# EAGLE design Fuen-var-Ardu (EAGLE 7.2.0)
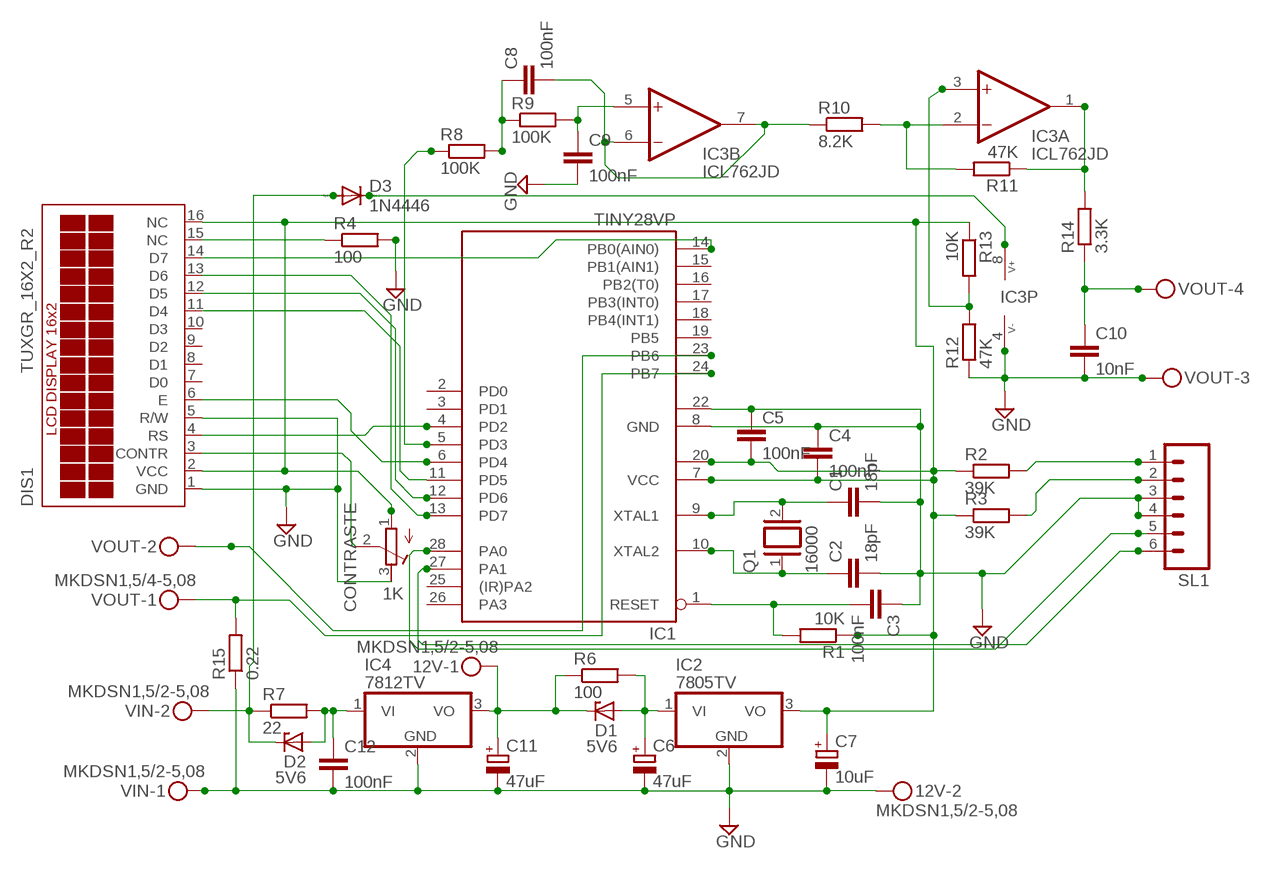
[diagram p0: schematic, sheet 1]

## Parts
12V  MKDSN1,5/2-5,08  [MKDSN1,5/2-5,08]
C1  18pF  C-EU025-025X050  [C025-025X050]
C2  18pF  C-EU025-025X050  [C025-025X050]
C3  100nF  C-EU050-025X075  [C050-025X075]
C4  100nF  C-EU075-032X103  [C075-032X103]
C5  100nF  C-EU050-025X075  [C050-025X075]
C6  47uF  CPOL-EUE2.5-7  [E2,5-7]
C7  10uF  CPOL-EUE2.5-7  [E2,5-7]
C8  100nF  C-EU050-025X075  [C050-025X075]
C9  100nF  C-EU050-025X075  [C050-025X075]
C10  10nF  C-EU050-025X075  [C050-025X075]
C11  47uF  CPOL-EUE2.5-7  [E2,5-7]
C12  100nF  C-EU050-025X075  [C050-025X075]
CONTRASTE  1K  R-TRIMM3296W  [RTRIM3296W]
D1  5V6  ZENER-DIODEDO35Z10  [DO35Z10]
D2  5V6  ZENER-DIODEDO35Z10  [DO35Z10]
D3  1N4446  [DO35-10]
DIS1  TUXGR_16X2_R2  [TUXGR_16X2_R2]
IC1  TINY28VP  [DIL28-3]
IC2  7805TV  [TO220V]
IC3  ICL762JD  [DIL08]
IC4  7812TV  [TO220V]
Q1  16000  XTAL  [Q]
R1  10K  R-EU_0207/10  [0207/10]
R2  39K  R-EU_0207/10  [0207/10]
R3  39K  R-EU_0207/10  [0207/10]
R4  100  R-EU_0207/15  [0207/15]
R6  100  R-EU_0411/12  [0411/12]
R7  22  R-EU_0411/12  [0411/12]
R8  100K  R-EU_0207/10  [0207/10]
R9  100K  R-EU_0207/10  [0207/10]
R10  8.2K  R-EU_0207/10  [0207/10]
R11  47K  R-EU_0207/10  [0207/10]
R12  47K  R-EU_0207/10  [0207/10]
R13  10K  R-EU_0207/10  [0207/10]
R14  3.3K  R-EU_0207/10  [0207/10]
R15  0.22  R-EU_0817/22  [P0817/22]
SL1  M06  [06P]
VIN  MKDSN1,5/2-5,08  [MKDSN1,5/2-5,08]
VOUT  MKDSN1,5/4-5,08  [MKDSN1,5/4-5,08]

## Nets
GND: 12V.2 C1.2 C2.2 C3.1 C4.1 C5.1 C6.- C7.- C9.2 C10.2 C11.- C12.2 IC1.8(GND) IC1.22(GND1) IC2.2(GND) IC3.4(P:V-) IC4.2(GND) R4.2 R12.1 R15.1 SL1.3 SL1.4 VIN.1 VOUT.3
N$1: C3.2 IC1.1(RESET) R1.2
N$2: C2.1 IC1.10(XTAL2) Q1.1
N$3: C1.1 IC1.9(XTAL1) Q1.2
N$4: C4.2 C5.2 C7.+ CONTRASTE.1(A) DIS1.2(VCC) DIS1.16(NC) IC1.7(VCC) IC1.20(VCC1) IC2.3(VO) R1.1 R2.1 R3.1 R13.1
N$5: DIS1.13(D6) IC1.13(PD7)
N$6: IC1.24(PB7) R15.2 VOUT.1
N$7: CONTRASTE.2(S) DIS1.3(CONTR)
N$8: DIS1.14(D7) IC1.14(PB0(AIN0))
N$9: CONTRASTE.3(E) DIS1.5(R/W)
N$10: D3.C IC3.8(P:V+)
N$11: DIS1.12(D5) IC1.12(PD6)
N$12: IC1.23(PB6) VOUT.2
N$13: IC1.27(PA1) SL1.6
N$14: DIS1.11(D4) IC1.11(PD5)
N$15: C6.+ D1.A IC2.1(VI) R6.2
N$16: R2.2 SL1.1
N$17: C10.1 R14.1 VOUT.4
N$18: DIS1.4(RS) IC1.4(PD2)
N$19: IC3.3(A:+IN) R12.2 R13.2
N$20: DIS1.15(NC) R4.1
N$21: DIS1.6(E) IC1.6(PD4)
N$22: 12V.1 C11.+ D1.C IC4.3(VO) R6.1
N$25: R3.2 SL1.2
N$26: IC3.1(A:OUT) R11.1 R14.2
N$27: C8.2 IC3.6(B:-IN) IC3.7(B:OUT) R10.1
N$28: IC3.2(A:-IN) R10.2 R11.2
N$30: C8.1 R8.2 R9.1
N$31: C9.1 IC3.5(B:+IN) R9.2
N$32: C12.1 D2.A IC4.1(VI) R7.2
N$33: IC1.5(PD3) R8.1
N$34: IC1.28(PA0) SL1.5
N$36: D2.C D3.A R7.1 VIN.2
Unconnected: DIS1.7(D0) DIS1.8(D1) DIS1.9(D2) DIS1.10(D3) IC1.2(PD0) IC1.3(PD1) IC1.15(PB1(AIN1)) IC1.16(PB2(T0)) IC1.17(PB3(INT0)) IC1.18(PB4(INT1)) IC1.19(PB5) IC1.21(NC1) IC1.25((IR)PA2) IC1.26(PA3)

## Power pins joined to a net without a drawn wire
GND: DIS1.1(GND)

## Library data of the parts
12V VIN = con-phoenix-508:MKDSN1,5/2-5,08: MKDSN 1,5/ 2-5,08 Printklemme Nennstrom: 13,5 A Nennspannung: 250 V Rastermaß: 5,08 mm Polzahl: 2 Anschlussart: Schraubanschluss Montage: Löten Anschlussrichtung Leiter/Platine: 0 ° Artikelnummer: 1729128 Source: http://eshop.phoenixcontact.com .. 1729128.pdf
C1-C5 C8-C10 C12 = rcl:C-EU: CAPACITOR, European symbol
C6 C7 C11 = rcl:CPOL-EU: POLARIZED CAPACITOR, European symbol
CONTRASTE = rcl:R-TRIMM: Trimm resistor
D1 D2 = diode:ZENER-DIODE: Z-Diode
D3 = diode:1N4446: DIODE high speed (Philips)
DIS1 = display-lcd:TUXGR_16X2_R2: Tuxgraphics LCD display 16x2 characters reflective, without background light Source: tuxgr_12x2_r2.pdf; OC_FARNELL: unknown; OC_NEWARK: unknown
IC1 = atmel:TINY28*P: MICROCONTROLLER 1.8 V 2 Kbytes FLASH; OC_FARNELL: unknown; OC_NEWARK: unknown
IC2 IC4 = linear:78*: Positive VOLTAGE REGULATOR Source: http://cache.national.com/ds/LM/LM78L05.pdf http://www.fairchildsemi.com/ds/LM/LM7805.pdf
IC3 = maxim:ICL762*: Dual Operational Amplifiers Source: http://datasheets.maxim-ic.com/en/ds/ICL7612-ICL764X.pdf; OC_FARNELL: unknown; OC_NEWARK: unknown
Q1 = special:XTAL: CRYSTAL
R1-R4 = resistor:R-EU_: RESISTOR, European symbol
R6-R15 = rcl:R-EU_: RESISTOR, European symbol
SL1 = con-amp-quick:M06: AMP QUICK CONNECTOR; OC_FARNELL: unknown; OC_NEWARK: unknown
VOUT = con-phoenix-508:MKDSN1,5/4-5,08: MKDSN 1,5/ 4-5,08 Printklemme Nennstrom: 13,5 A Nennspannung: 250 V Rastermaß: 5,08 mm Polzahl: 4 Anschlussart: Schraubanschluss Montage: Löten Anschlussrichtung Leiter/Platine: 0 ° Artikelnummer: 1729144 Source: http://eshop.phoenixcontact.com .. 1729144.pdf

## Board
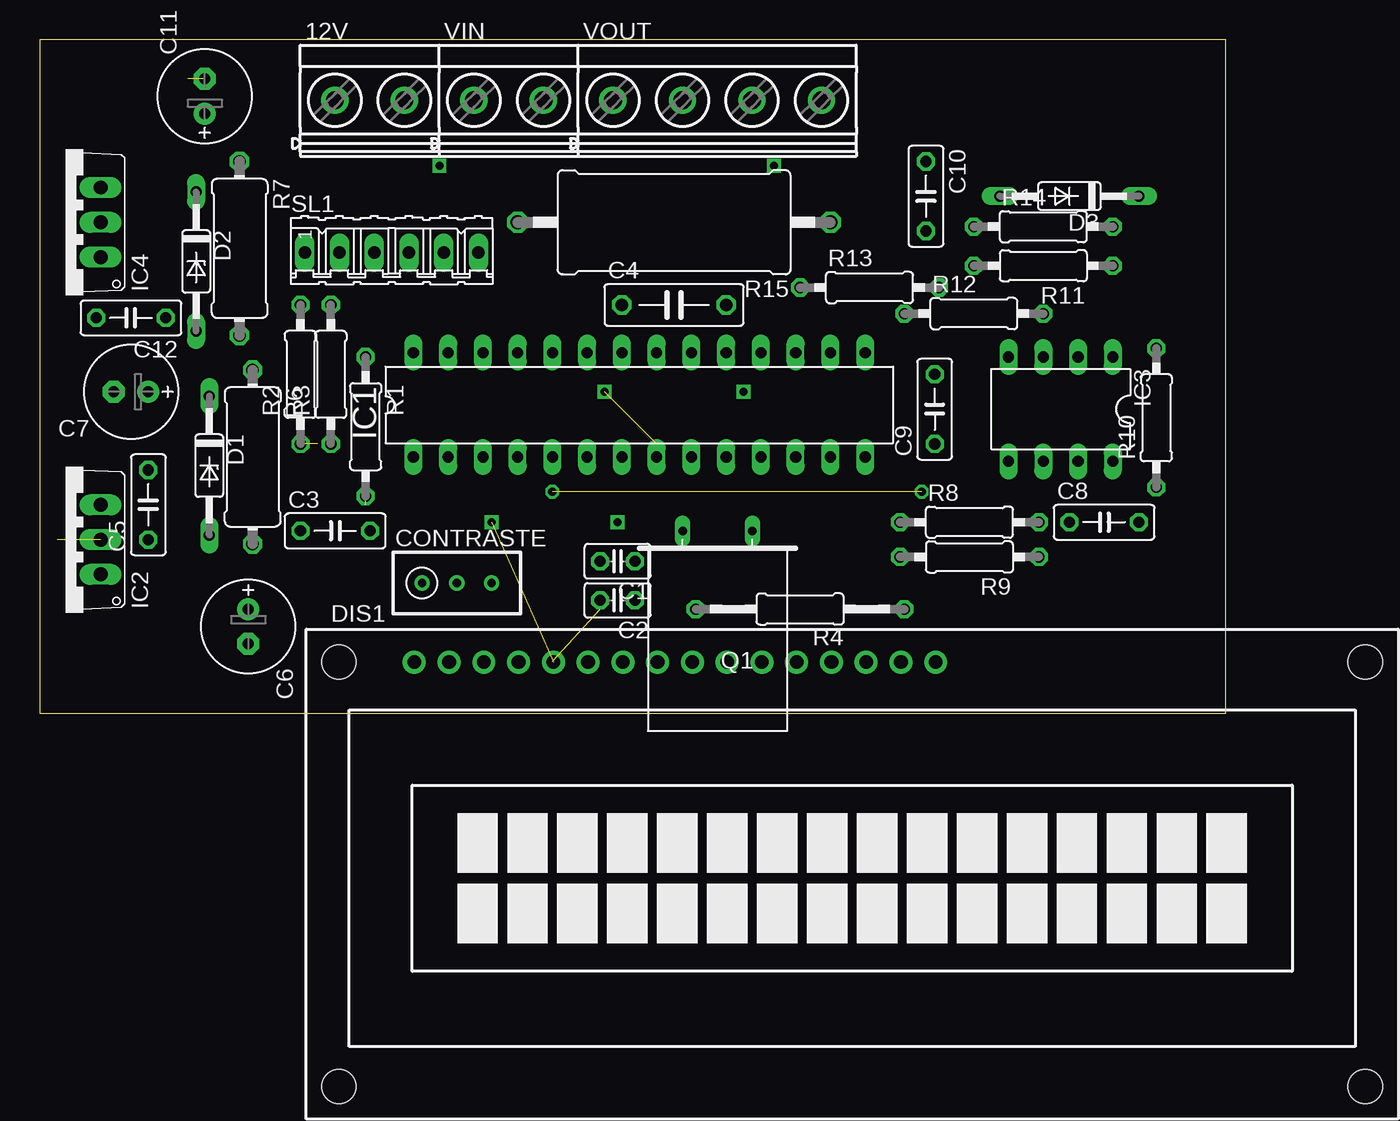
[diagram p1: board, top side]
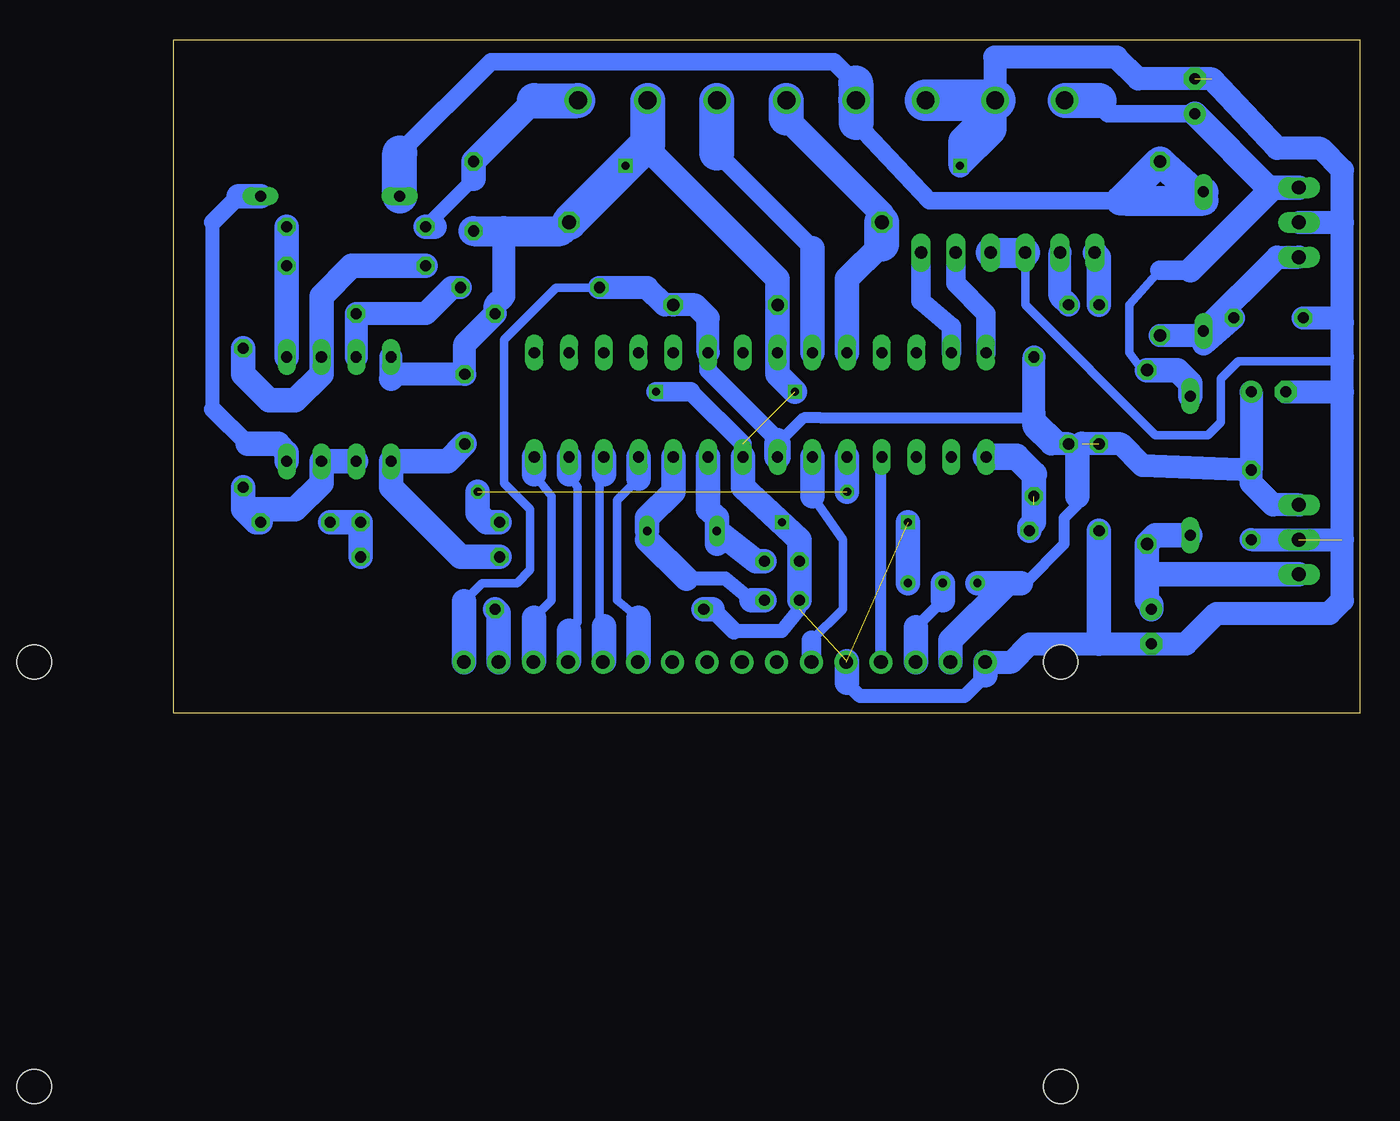
[diagram p2: board, bottom side, seen from below]

Size 86.66 x 49.2 mm. Coordinates in mm from the lower left corner, seen from the top.
Outline: 0,0 86.66,0 86.66,49.2 0,49.2 0,0
Copper layers (1*16): Top 0.035mm / dielectric 1.5mm / Bottom 0.035mm
Design rules "default": minimum track width 10mil, minimum drill 24mil, track to track 8mil, track to pad 8mil, pad to pad 8mil, via to via 8mil, smd to smd 8mil, copper to edge 40mil, drill to drill 8mil, minimum pad ring 10mil, minimum via ring 8mil, stop-mask expansion 4mil, vias tented up to drill 0mil, thermal gap 10mil

### Footprints (pad centres in the part's own frame; a part is rotated, then mirrored left to right if it is on the bottom)
MKDSN1,5/2-5,08 = drill 1.3 pad 2: 1 -2.561,0.025; 2 2.519,0.025
C025-025X050 = drill 0.813 octagon: 1 -1.27,0; 2 1.27,0
C050-025X075 = drill 0.813 octagon: 1 -2.54,0; 2 2.54,0
C075-032X103 = drill 0.914 octagon: 1 -3.81,0; 2 3.81,0
E2,5-7 = drill 0.813 pad 1.6: + -1.27,0 | drill 0.813 pad 1.6 octagon: - 1.27,0
RTRIM3296W = drill 0.61: 1 0,-2.54; 2 0,0; 3 0,2.54
DO35Z10 = drill 0.813 long: A 5.08,0; C -5.08,0
DO35-10 = drill 0.813 long: A 5.08,0; C -5.08,0
TUXGR_16X2_R2 = drill 1 pad 1.676: 1 -32,15.5; 2 -29.46,15.5; 3 -26.92,15.5; 4 -24.38,15.5; 5 -21.84,15.5; 6 -19.3,15.5; 7 -16.76,15.5; 8 -14.22,15.5; 9 -11.68,15.5; 10 -9.14,15.5; 11 -6.6,15.5; 12 -4.06,15.5; 13 -1.52,15.5; 14 1.02,15.5; 15 3.56,15.5; 16 6.1,15.5 | hole 2.5: -37.5,-15.5; 37.5,-15.5; -37.5,15.5; 37.5,15.5
DIL28-3 = drill 0.813 long: 1 -16.51,-3.81; 2 -13.97,-3.81; 3 -11.43,-3.81; 4 -8.89,-3.81; 5 -6.35,-3.81; 6 -3.81,-3.81; 7 -1.27,-3.81; 8 1.27,-3.81; 9 3.81,-3.81; 10 6.35,-3.81; 11 8.89,-3.81; 12 11.43,-3.81; 13 13.97,-3.81; 14 16.51,-3.81; 15 16.51,3.81; 16 13.97,3.81; 17 11.43,3.81; 18 8.89,3.81; 19 6.35,3.81; 20 3.81,3.81; 21 1.27,3.81; 22 -1.27,3.81; 23 -3.81,3.81; 24 -6.35,3.81; 25 -8.89,3.81; 26 -11.43,3.81; 27 -13.97,3.81; 28 -16.51,3.81
TO220V = drill 1.016 long: 1 -2.54,-2.54; 2 0,-2.54; 3 2.54,-2.54
DIL08 = drill 0.813 long: 1 -3.81,-3.81; 2 -1.27,-3.81; 3 1.27,-3.81; 4 3.81,-3.81; 5 3.81,3.81; 6 1.27,3.81; 7 -1.27,3.81; 8 -3.81,3.81
Q = drill 0.61 long: 1 -2.54,-7.62; 2 2.54,-7.62
0207/10 = drill 0.813 octagon: 1 -5.08,0; 2 5.08,0
0207/15 = drill 0.813 octagon: 1 -7.62,0; 2 7.62,0
0411/12 = drill 0.914 octagon: 1 -6.35,0; 2 6.35,0
P0817/22 = drill 1.016 octagon: 1 -11.43,0; 2 11.43,0
06P = drill 0.914 long: 1 -6.35,0; 2 -3.81,0; 3 -1.27,0; 4 1.27,0; 5 3.81,0; 6 6.35,0
MKDSN1,5/4-5,08 = drill 1.3 pad 2: 1 -7.641,0.025; 2 -2.561,0.025; 3 2.519,0.025; 4 7.599,0.025

### Placement (x,y rotation side)
12V  24.13,44.77 0 top
C1  42.23,11.11 180 top
C2  42.23,8.26 180 top
C3  21.59,13.33 0 top
C4  46.36,29.84 0 top
C5  7.94,15.24 90 top
C6  15.24,6.35 270 top
C7  6.67,23.49 180 top
C8  77.79,13.97 0 top
C9  65.41,22.23 90 top
C10  64.77,37.78 270 top
C11  12.06,45.09 90 top
C12  6.67,28.89 180 top
CONTRASTE  30.48,9.53 270 top
D1  12.38,18.1 270 top
D2  11.43,33.02 270 top
D3  75.25,37.78 180 top
DIS1  59.37,-11.75 0 top
IC1  43.82,22.54 0 top
IC2  1.91,12.7 90 top
IC3  74.61,22.23 180 top
IC4  1.91,35.88 90 top
Q1  49.53,5.72 180 top
R1  23.81,20.95 270 top
R2  19.05,24.77 90 top
R3  21.27,24.77 90 top
R4  55.56,7.62 180 top
R6  15.56,18.73 270 top
R7  14.61,33.97 270 top
R8  67.94,13.97 0 top
R9  67.94,11.43 180 top
R10  81.6,21.59 90 top
R11  73.34,32.7 180 top
R12  68.26,29.21 0 top
R13  60.64,31.12 0 top
R14  73.34,35.56 0 top
R15  46.36,35.88 180 top
SL1  25.72,33.66 0 top
VIN  34.29,44.77 0 top
VOUT  49.53,44.77 0 top

### Tracks (layer width: path | path; a pad name or v marks a point on that pad's centre or on a via)
GND  (via drill 0.6)  (4 unrouted)
  Bottom 0.61: SL1.3 24.45,29.85 14.92,20.32 11.11,20.32 10.16,21.27 10.16,24.45 8.89,25.72 1.59,25.72 1.27,26.03 | 40.96,7.62 C2.2
  Bottom 1.016: 45.72,6.03 42.23,6.03 40.96,7.62 | 27.37,2.79 28.89,1.27 36.51,1.27 37.47,2.22
  Bottom 1.27: 47.31,7.62 45.72,6.03 | IC1.8 45.09,19.68 48.9,23.49
  Bottom 1.422: 48.9,23.49 51.44,23.49
  Bottom 1.676: DIS1.1 25.46,3.75 24.13,5.08 19.05,5.08 17.46,5.08 C6.- 12.7,5.08 10.48,7.3 2.22,7.3 1.27,8.26 1.27,12.7 | 1.27,12.7 1.27,23.49 | 1.27,23.49 1.27,26.03 1.27,28.57 | 1.27,28.57 1.27,35.88 | 1.27,35.88 1.27,39.69 2.86,41.27 6.03,41.27 10.79,46.35 16.19,46.35 17.78,47.94 26.67,47.94 26.67,42.55 29.21,40 29.21,41.91 26.99,44.13 26.99,44.45 12V.2 | 29.84,44.77 31.7,44.77 VIN.1 | C12.2 1.59,28.89 1.27,28.57 | C7.- 1.27,23.49 | IC4.2 1.27,35.88 | C5.1 1.27,12.7 | 70.48,24.77 C9.2 65.41,26.99 R12.1 63.18,29.85 62.55,30.48 62.55,35.24 | 70.8,24.45 IC3.4
  Bottom 1.778: 70.48,24.77 70.8,24.45 | C2.2 C1.2 40.96,12.7 45.09,16.51 IC1.8 | R4.2 47.31,7.62 | C3.1 19.05,5.08 | 52.23,41.43 42.55,31.75 C4.1 IC1.22 42.55,24.77 41.28,23.49 | DIS1.1 27.37,2.79 | 37.47,2.22 37.47,3.81
  Bottom 2.184: SL1.4 SL1.3 | C10.2 62.55,35.24 58.42,35.24 R15.1
  Bottom 2.54: VOUT.3 52.05,41.61 52.23,41.43 v53.66,40 R15.1
  Bottom 3.048: 12V.2 VIN.1
N$1  (1 unrouted)
  Bottom 1.778: 23.81,17.46 23.81,15.24 23.81,14.6 23.81,13.97 24.13,13.65 C3.2
  Bottom 1.93: 23.81,17.46 25.08,18.73 IC1.1
N$2
  Bottom 1.016: 52.07,12.7 Q1.1 | 44.45,8.26 46.36,9.84 49.21,9.84
  Bottom 1.778: Q1.1 52.07,14.29 50.17,16.19 IC1.10 | C2.1 44.45,8.26 | 49.21,9.84 52.07,12.7
N$3
  Bottom 1.778: 46.99,12.38 Q1.2 | Q1.2 46.99,14.29 47.62,14.92 IC1.9 | C1.1 44.13,11.11 Q1.2
N$4  (1 unrouted)
  Bottom 0.61: 65.47,8.19 64.14,9.52 61.6,9.52 60.64,10.48 60.64,14.92 62.55,16.83 62.55,27.31 58.74,31.12 R13.1
  Bottom 0.813: 24.77,9.52 24.45,9.52 21.59,12.38 21.59,14.29 20.64,15.24 20.64,18.1 | 42.55,19.68 40.64,21.59 39.37,21.59 23.81,21.59
  Bottom 1.016: 20.32,19.68 R3.1 21.59,19.68 23.81,21.91
  Bottom 1.27: 42.55,20 47.62,25.08 IC1.20
  Bottom 1.676: C7.+ C5.2 | C5.2 15.88,18.1 17.46,19.68 20.32,19.68 | R3.1 22.54,19.68 23.81,20.95 23.81,21.59 23.81,21.91 R1.1 | IC2.3 6.35,15.24 7.94,16.83 C5.2 | 42.55,19.68 42.55,20 | IC1.20 47.62,28.89 48.58,29.85 C4.2 50.8,29.85 52.07,31.12 R13.1
  Bottom 1.778: DIS1.16 65.47,8.19 | CONTRASTE.1 25.72,9.52 | 25.72,9.52 24.77,9.52 | 20.64,15.88 20.64,18.1 20.64,19.37 20.32,19.68 | DIS1.2 29.91,5.33 25.72,9.52
  Bottom 1.93: IC1.7 42.55,19.68
N$5
  Bottom 0.61: DIS1.13 57.79,3.82 | 57.79,6.03 57.15,6.67 57.15,16.51 57.79,17.46
  Bottom 1.778: 57.79,3.82 57.79,6.03 | 57.79,17.46 IC1.13
N$6
  Bottom 1.778: IC1.24 37.47,31.75 34.93,34.29 | R15.2 34.93,36.51 41.91,43.5 | 41.91,44.77 VOUT.1
  Bottom 2.54: 34.93,34.29 R15.2 | 41.91,43.5 41.91,44.77
N$7
  Bottom 0.813: 32.45,6.28 30.48,8.26
  Bottom 1.778: DIS1.3 32.45,6.28 | 30.48,8.26 CONTRASTE.2
N$8
  Bottom 0.61: DIS1.14 60.33,3.82 | 60.33,6.99 59.05,8.26 59.05,15.88 60.33,17.46
  Bottom 1.778: 60.33,3.82 60.33,6.99 | 60.33,17.46 IC1.14
N$9  (1 unrouted)
  Bottom 1.778: CONTRASTE.3 33.02,13.97
N$10
  Bottom 1.016: 83.82,22.23 83.82,35.88
  Bottom 1.27: 81.28,19.68 83.82,22.23 | 83.82,35.88 81.91,37.78
  Bottom 1.778: IC3.8 78.42,19.05 79.06,19.68 81.28,19.68 | 81.91,37.78 D3.C
N$11
  Bottom 0.61: DIS1.12 55.25,3.82 | 55.25,6.35 55.56,6.67 55.56,17.15 55.25,17.46
  Bottom 1.778: 55.25,3.82 55.25,6.35 | 55.25,17.46 IC1.12
N$12
  Bottom 1.27: 40.01,33.97 46.99,40.96
  Bottom 1.778: IC1.23 40.01,33.97 | 46.99,44.77 VOUT.2
  Bottom 2.54: 46.99,40.96 46.99,44.77
N$13
  Bottom 1.422: IC1.27 29.84,28.26 32.07,30.16 SL1.6
N$14
  Bottom 0.61: DIS1.11 52.71,3.82 | 52.71,6.99 54.29,8.26 54.29,15.56 52.71,17.15
  Bottom 1.778: 52.71,3.82 52.71,6.99 | 52.71,17.15 IC1.11
N$15
  Bottom 1.778: C6.+ 15.24,7.94 15.56,8.26 15.56,9.84 | 15.56,9.84 R6.2 14.92,13.02 D1.A | IC2.1 15.24,10.16 15.56,9.84
N$16
  Bottom 1.778: R2.2 19.05,33.34 SL1.1
N$17
  Bottom 1.016: 67.63,35.56 67.63,36.2 64.77,39.05
  Bottom 1.778: R14.1 67.63,35.56 | 64.77,39.05 C10.1 60.33,44.77 | 57.15,44.77 VOUT.4
  Bottom 2.54: 60.33,44.77 57.15,44.77
N$18
  Bottom 0.61: 34.99,18.03 34.93,18.1 IC1.4
  Bottom 0.813: DIS1.4 34.99,18.03
N$19
  Bottom 1.676: R13.2 66.36,31.12 68.26,29.21 R12.2 IC3.3
N$20
  Bottom 1.778: DIS1.15 62.93,7.37 R4.1
N$21
  Bottom 0.61: 40.07,5.33 37.78,7.62 37.78,12.7 40.01,15.88
  Bottom 1.422: DIS1.6 40.07,5.33
  Bottom 1.778: 40.01,15.88 IC1.6
N$22
  Bottom 0.61: 14.61,32.38 16.83,29.85 16.83,26.35 15.88,25.08 R6.1
  Bottom 1.27: C11.+ 18.41,43.81 19.05,44.77 | 21.54,44.77 12V.1
  Bottom 1.422: 12.38,32.38 14.61,32.38
  Bottom 1.778: D1.C 12.38,24.13 13.33,25.08 R6.1 | IC4.3 6.35,38.42 | 6.35,38.42 6.67,38.42 C11.+ | 6.35,38.42 12.38,32.38
  Bottom 2.54: 19.05,44.77 21.54,44.77
N$23  (via drill 0.6)
  other vias: 64.45,16.19
N$24  (via drill 0.6)
  other vias: 37.47,16.19
N$25
  Bottom 1.676: R3.2 21.91,30.48 SL1.2
N$26
  Bottom 1.778: IC3.1 R11.1 R14.2
N$27
  Bottom 1.778: IC3.6 IC3.7 75.88,16.83 77.79,14.92 81.28,14.92 81.6,15.24 | C8.2 80.64,13.97 81.6,14.92 81.6,15.24 | 81.6,15.24 R10.1
N$28
  Bottom 1.778: R11.2 73.66,32.7 75.88,30.48 IC3.2 75.88,24.77 77.79,22.86 79.69,22.86 81.6,24.77 R10.2
N$29  (via drill 0.6)
  other vias: 29.21,40
N$30
  Bottom 1.778: R9.1 R8.2 C8.1
N$31
  Bottom 1.778: C9.1 66.67,18.42 IC3.5 70.8,16.51 65.72,11.43 R9.2
N$32
  Bottom 1.676: D2.A 6.03,33.34 IC4.1 | C12.1 11.43,26.99 | 11.43,26.99 10.48,27.94 D2.A | 11.43,26.99 D2.A | R7.2 11.75,27.62 D2.A
N$33  (1 unrouted)
  Bottom 1.778: IC1.5 37.47,16.19 | R8.1 63.82,13.97 64.45,14.6 64.45,16.19
N$34
  Bottom 1.422: IC1.28 27.3,29.21 29.53,31.43 SL1.5
N$36
  Bottom 1.27: 36.81,43.16 31.43,37.46 17.46,37.46 17.14,37.46 | 70.17,40.96 63.5,47.63 38.42,47.63 36.83,46.04
  Bottom 2.184: 17.46,37.46 R7.1 11.43,37.46 | 11.43,37.46 D2.C | 17.14,37.46 11.43,37.46
  Bottom 2.54: 36.81,43.16 VIN.2 36.83,44.81 36.83,46.04 | D3.A 70.17,40.96
N$37  (via drill 0.6)
  other vias: 42.23,13.97
N$38  (via drill 0.6)
  other vias: 33.02,13.97
N$39  (via drill 0.6)
  other vias: 41.28,23.49
N$40  (via drill 0.6)
  other vias: 51.44,23.49